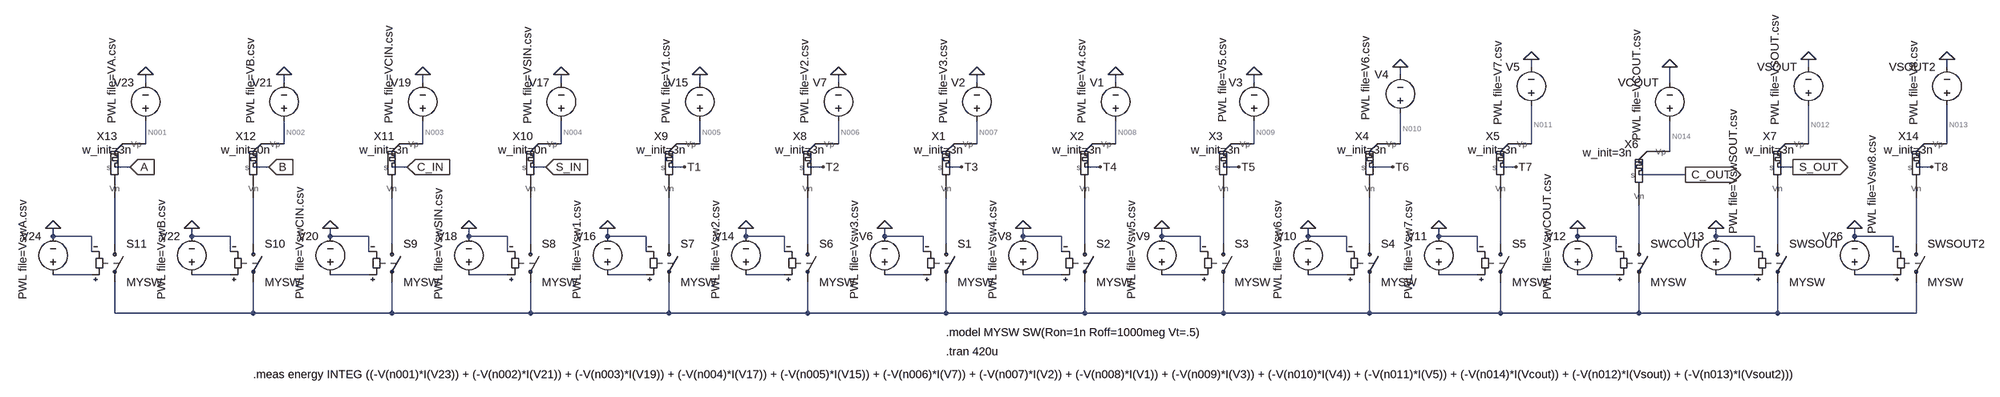
[diagram p0: schematic approx2_PPU.asc]
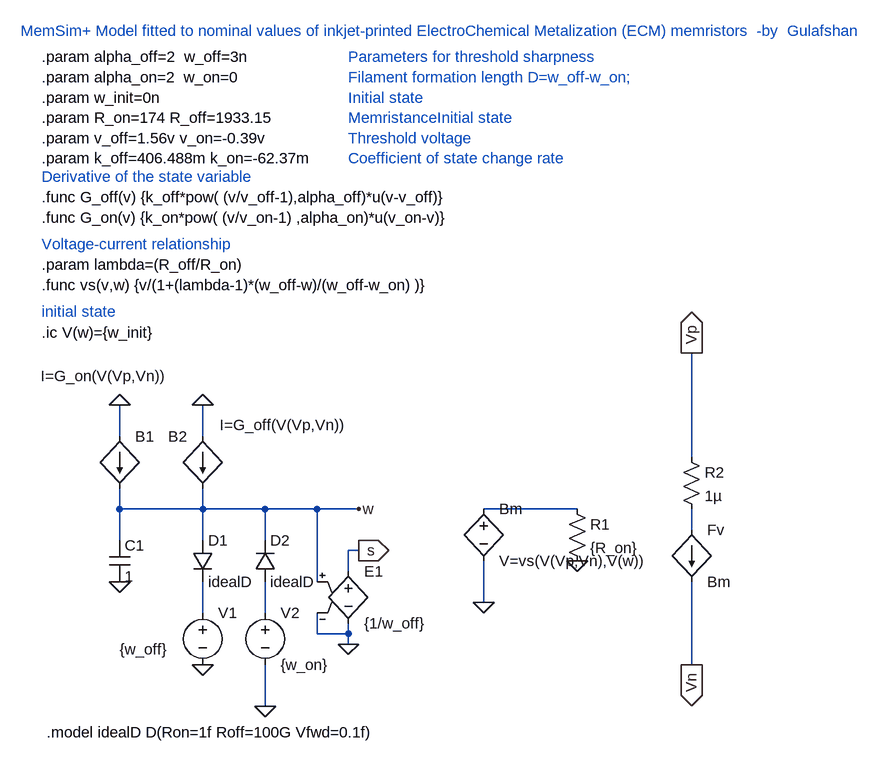
[diagram p1: sub-circuit memsim+ecm_nominal.asc]
approx2_PPU.asc, the LTspice schematic file:
Version 4
SHEET 1 3080 680
WIRE 1200 -16 1200 -32
WIRE 1776 -16 1776 -32
WIRE 2064 -16 2064 -32
WIRE 928 0 928 -16
WIRE -1680 16 -1680 0
WIRE -1392 16 -1392 0
WIRE -1104 16 -1104 0
WIRE -816 16 -816 0
WIRE -528 16 -528 0
WIRE -240 16 -240 0
WIRE 48 16 48 0
WIRE 336 16 336 0
WIRE 624 16 624 0
WIRE 1488 16 1488 -16
WIRE -1680 144 -1680 96
WIRE -1392 144 -1392 96
WIRE -1104 144 -1104 96
WIRE -816 144 -816 96
WIRE -528 144 -528 96
WIRE -240 144 -240 96
WIRE 48 144 48 96
WIRE 336 144 336 96
WIRE 624 144 624 96
WIRE 928 144 928 80
WIRE 1200 144 1200 64
WIRE 1776 144 1776 64
WIRE 2064 144 2064 64
WIRE 1488 160 1488 96
WIRE -1712 192 -1744 192
WIRE -1424 192 -1456 192
WIRE -1136 192 -1168 192
WIRE -848 192 -880 192
WIRE -560 192 -592 192
WIRE -272 192 -304 192
WIRE 16 192 -16 192
WIRE 304 192 272 192
WIRE 592 192 560 192
WIRE 912 192 864 192
WIRE 1168 192 1136 192
WIRE 1744 192 1712 192
WIRE 2032 192 2000 192
WIRE 1520 208 1424 208
WIRE -1872 336 -1872 320
WIRE -1792 336 -1872 336
WIRE -1584 336 -1584 320
WIRE -1504 336 -1584 336
WIRE -1296 336 -1296 320
WIRE -1216 336 -1296 336
WIRE -1008 336 -1008 320
WIRE -928 336 -1008 336
WIRE -720 336 -720 320
WIRE -640 336 -720 336
WIRE -432 336 -432 320
WIRE -352 336 -432 336
WIRE -144 336 -144 320
WIRE -64 336 -144 336
WIRE 144 336 144 320
WIRE 224 336 144 336
WIRE 432 336 432 320
WIRE 512 336 432 336
WIRE 736 336 736 320
WIRE 816 336 736 336
WIRE 1008 336 1008 320
WIRE 1088 336 1008 336
WIRE 1296 336 1296 320
WIRE 1376 336 1296 336
WIRE 1584 336 1584 320
WIRE 1664 336 1584 336
WIRE 1872 336 1872 320
WIRE 1952 336 1872 336
WIRE -1744 352 -1744 256
WIRE -1456 352 -1456 256
WIRE -1168 352 -1168 256
WIRE -880 352 -880 256
WIRE -592 352 -592 256
WIRE -304 352 -304 256
WIRE -16 352 -16 256
WIRE 272 352 272 256
WIRE 560 352 560 256
WIRE 864 352 864 256
WIRE 1136 352 1136 256
WIRE 1424 352 1424 272
WIRE 1712 352 1712 256
WIRE 2000 352 2000 256
WIRE -1792 368 -1792 336
WIRE -1504 368 -1504 336
WIRE -1216 368 -1216 336
WIRE -928 368 -928 336
WIRE -640 368 -640 336
WIRE -352 368 -352 336
WIRE -64 368 -64 336
WIRE 224 368 224 336
WIRE 512 368 512 336
WIRE 816 368 816 336
WIRE 1088 368 1088 336
WIRE 1376 368 1376 336
WIRE 1664 368 1664 336
WIRE 1952 368 1952 336
WIRE -1792 416 -1872 416
WIRE -1504 416 -1584 416
WIRE -1216 416 -1296 416
WIRE -928 416 -1008 416
WIRE -640 416 -720 416
WIRE -352 416 -432 416
WIRE -64 416 -144 416
WIRE 224 416 144 416
WIRE 512 416 432 416
WIRE 816 416 736 416
WIRE 1088 416 1008 416
WIRE 1376 416 1296 416
WIRE 1664 416 1584 416
WIRE 1952 416 1872 416
WIRE -1744 496 -1744 432
WIRE -1456 496 -1456 432
WIRE -1456 496 -1744 496
WIRE -1168 496 -1168 432
WIRE -1168 496 -1456 496
WIRE -880 496 -880 432
WIRE -880 496 -1168 496
WIRE -592 496 -592 432
WIRE -592 496 -880 496
WIRE -304 496 -304 432
WIRE -304 496 -592 496
WIRE -16 496 -16 432
WIRE -16 496 -304 496
WIRE 272 496 272 432
WIRE 272 496 -16 496
WIRE 560 496 560 432
WIRE 560 496 272 496
WIRE 864 496 864 432
WIRE 864 496 560 496
WIRE 1136 496 1136 432
WIRE 1136 496 864 496
WIRE 1424 496 1424 432
WIRE 1424 496 1136 496
WIRE 1712 496 1712 432
WIRE 1712 496 1424 496
WIRE 2000 496 2000 432
WIRE 2000 496 1712 496
FLAG 304 192 T4
FLAG 336 0 0
FLAG 624 0 0
FLAG 928 -16 0
FLAG 1200 -32 0
FLAG 1488 -16 0
FLAG 144 320 0
FLAG 432 320 0
FLAG 736 320 0
FLAG 1008 320 0
FLAG 1296 320 0
FLAG 1776 -32 0
FLAG 1584 320 0
FLAG 1744 192 S_OUT
IOPIN 1744 192 Out
FLAG 592 192 T5
FLAG 912 192 T6
FLAG 1168 192 T7
FLAG 1520 208 C_OUT
IOPIN 1520 208 Out
FLAG 16 192 T3
FLAG 48 0 0
FLAG -144 320 0
FLAG -272 192 T2
FLAG -240 0 0
FLAG -432 320 0
FLAG -560 192 T1
FLAG -528 0 0
FLAG -720 320 0
FLAG -848 192 S_IN
IOPIN -848 192 In
FLAG -816 0 0
FLAG -1008 320 0
FLAG -1136 192 C_IN
IOPIN -1136 192 In
FLAG -1104 0 0
FLAG -1296 320 0
FLAG -1424 192 B
IOPIN -1424 192 In
FLAG -1392 0 0
FLAG -1584 320 0
FLAG -1712 192 A
IOPIN -1712 192 In
FLAG -1680 0 0
FLAG -1872 320 0
FLAG 2064 -32 0
FLAG 1872 320 0
FLAG 2032 192 T8
SYMBOL MemSim+ECM_Nominal 224 144 R0
WINDOW 39 32 28 Bottom 2
SYMATTR SpiceLine w_init=3n
SYMATTR InstName X2
SYMBOL MemSim+ECM_Nominal 512 144 R0
WINDOW 39 32 28 Bottom 2
SYMATTR SpiceLine w_init=3n
SYMATTR InstName X3
SYMBOL MemSim+ECM_Nominal 816 144 R0
WINDOW 39 32 28 Bottom 2
SYMATTR SpiceLine w_init=3n
SYMATTR InstName X4
SYMBOL MemSim+ECM_Nominal 1088 144 R0
WINDOW 39 32 28 Bottom 2
SYMATTR SpiceLine w_init=3n
SYMATTR InstName X5
SYMBOL MemSim+ECM_Nominal 1376 160 R0
WINDOW 39 -18 18 Bottom 2
SYMATTR SpiceLine w_init=3n
SYMATTR InstName X6
SYMBOL voltage 336 112 R180
WINDOW 0 24 96 Left 2
WINDOW 3 70 10 VRight 2
WINDOW 123 0 0 Left 2
WINDOW 39 0 0 Left 2
SYMATTR InstName V1
SYMATTR Value PWL file=V4.csv
SYMBOL voltage 624 112 R180
WINDOW 0 24 96 Left 2
WINDOW 3 66 13 VRight 2
WINDOW 123 0 0 Left 2
WINDOW 39 0 0 Left 2
SYMATTR InstName V3
SYMATTR Value PWL file=V5.csv
SYMBOL voltage 928 96 R180
WINDOW 0 24 96 Left 2
WINDOW 3 72 1 VRight 2
WINDOW 123 0 0 Left 2
WINDOW 39 0 0 Left 2
SYMATTR InstName V4
SYMATTR Value PWL file=V6.csv
SYMBOL voltage 1200 80 R180
WINDOW 0 24 96 Left 2
WINDOW 3 69 -25 VRight 2
WINDOW 123 0 0 Left 2
WINDOW 39 0 0 Left 2
SYMATTR InstName V5
SYMATTR Value PWL file=V7.csv
SYMBOL sw 272 336 R0
SYMATTR InstName S2
SYMATTR Value MYSW
SYMBOL voltage 144 432 R180
WINDOW 0 24 96 Left 2
WINDOW 3 63 -36 VRight 2
WINDOW 123 0 0 Left 2
WINDOW 39 0 0 Left 2
SYMATTR InstName V8
SYMATTR Value PWL file=Vsw4.csv
SYMBOL sw 560 336 R0
SYMATTR InstName S3
SYMATTR Value MYSW
SYMBOL voltage 432 432 R180
WINDOW 0 24 96 Left 2
WINDOW 3 63 -36 VRight 2
WINDOW 123 0 0 Left 2
WINDOW 39 0 0 Left 2
SYMATTR InstName V9
SYMATTR Value PWL file=Vsw5.csv
SYMBOL sw 864 336 R0
SYMATTR InstName S4
SYMATTR Value MYSW
SYMBOL voltage 736 432 R180
WINDOW 0 24 96 Left 2
WINDOW 3 63 -36 VRight 2
WINDOW 123 0 0 Left 2
WINDOW 39 0 0 Left 2
SYMATTR InstName V10
SYMATTR Value PWL file=Vsw6.csv
SYMBOL sw 1136 336 R0
SYMATTR InstName S5
SYMATTR Value MYSW
SYMBOL voltage 1008 432 R180
WINDOW 0 24 96 Left 2
WINDOW 3 63 -36 VRight 2
WINDOW 123 0 0 Left 2
WINDOW 39 0 0 Left 2
SYMATTR InstName V11
SYMATTR Value PWL file=Vsw7.csv
SYMBOL sw 1424 336 R0
SYMATTR InstName SWCOUT
SYMATTR Value MYSW
SYMBOL voltage 1296 432 R180
WINDOW 0 24 96 Left 2
WINDOW 3 63 -36 VRight 2
WINDOW 123 0 0 Left 2
WINDOW 39 0 0 Left 2
SYMATTR InstName V12
SYMATTR Value PWL file=VswCOUT.csv
SYMBOL MemSim+ECM_Nominal 1664 144 R0
WINDOW 39 32 28 Bottom 2
SYMATTR SpiceLine w_init=3n
SYMATTR InstName X7
SYMBOL voltage 1488 112 R180
WINDOW 0 24 96 Left 2
WINDOW 3 69 -25 VRight 2
WINDOW 123 0 0 Left 2
WINDOW 39 0 0 Left 2
SYMATTR InstName VCOUT
SYMATTR Value PWL file=VCOUT.csv
SYMBOL sw 1712 336 R0
SYMATTR InstName SWSOUT
SYMATTR Value MYSW
SYMBOL voltage 1584 432 R180
WINDOW 0 24 96 Left 2
WINDOW 3 -36 100 VRight 2
WINDOW 123 0 0 Left 2
WINDOW 39 0 0 Left 2
SYMATTR InstName V13
SYMATTR Value PWL file=VswSOUT.csv
SYMBOL voltage 1776 80 R180
WINDOW 0 24 96 Left 2
WINDOW 3 69 -25 VRight 2
WINDOW 123 0 0 Left 2
WINDOW 39 0 0 Left 2
SYMATTR InstName VSOUT
SYMATTR Value PWL file=VSOUT.csv
SYMBOL MemSim+ECM_Nominal -64 144 R0
WINDOW 39 32 28 Bottom 2
SYMATTR SpiceLine w_init=3n
SYMATTR InstName X1
SYMBOL voltage 48 112 R180
WINDOW 0 24 96 Left 2
WINDOW 3 70 10 VRight 2
WINDOW 123 0 0 Left 2
WINDOW 39 0 0 Left 2
SYMATTR InstName V2
SYMATTR Value PWL file=V3.csv
SYMBOL sw -16 336 R0
SYMATTR InstName S1
SYMATTR Value MYSW
SYMBOL voltage -144 432 R180
WINDOW 0 24 96 Left 2
WINDOW 3 63 -36 VRight 2
WINDOW 123 0 0 Left 2
WINDOW 39 0 0 Left 2
SYMATTR InstName V6
SYMATTR Value PWL file=Vsw3.csv
SYMBOL MemSim+ECM_Nominal -352 144 R0
WINDOW 39 32 28 Bottom 2
SYMATTR SpiceLine w_init=3n
SYMATTR InstName X8
SYMBOL voltage -240 112 R180
WINDOW 0 24 96 Left 2
WINDOW 3 70 10 VRight 2
WINDOW 123 0 0 Left 2
WINDOW 39 0 0 Left 2
SYMATTR InstName V7
SYMATTR Value PWL file=V2.csv
SYMBOL sw -304 336 R0
SYMATTR InstName S6
SYMATTR Value MYSW
SYMBOL voltage -432 432 R180
WINDOW 0 24 96 Left 2
WINDOW 3 63 -36 VRight 2
WINDOW 123 0 0 Left 2
WINDOW 39 0 0 Left 2
SYMATTR InstName V14
SYMATTR Value PWL file=Vsw2.csv
SYMBOL MemSim+ECM_Nominal -640 144 R0
WINDOW 39 32 28 Bottom 2
SYMATTR SpiceLine w_init=3n
SYMATTR InstName X9
SYMBOL voltage -528 112 R180
WINDOW 0 24 96 Left 2
WINDOW 3 70 10 VRight 2
WINDOW 123 0 0 Left 2
WINDOW 39 0 0 Left 2
SYMATTR InstName V15
SYMATTR Value PWL file=V1.csv
SYMBOL sw -592 336 R0
SYMATTR InstName S7
SYMATTR Value MYSW
SYMBOL voltage -720 432 R180
WINDOW 0 24 96 Left 2
WINDOW 3 63 -36 VRight 2
WINDOW 123 0 0 Left 2
WINDOW 39 0 0 Left 2
SYMATTR InstName V16
SYMATTR Value PWL file=Vsw1.csv
SYMBOL MemSim+ECM_Nominal -928 144 R0
WINDOW 39 32 28 Bottom 2
SYMATTR SpiceLine w_init=0n
SYMATTR InstName X10
SYMBOL voltage -816 112 R180
WINDOW 0 24 96 Left 2
WINDOW 3 70 10 VRight 2
WINDOW 123 0 0 Left 2
WINDOW 39 0 0 Left 2
SYMATTR InstName V17
SYMATTR Value PWL file=VSIN.csv
SYMBOL sw -880 336 R0
SYMATTR InstName S8
SYMATTR Value MYSW
SYMBOL voltage -1008 432 R180
WINDOW 0 24 96 Left 2
WINDOW 3 63 -36 VRight 2
WINDOW 123 0 0 Left 2
WINDOW 39 0 0 Left 2
SYMATTR InstName V18
SYMATTR Value PWL file=VswSIN.csv
SYMBOL MemSim+ECM_Nominal -1216 144 R0
WINDOW 39 32 28 Bottom 2
SYMATTR SpiceLine w_init=3n
SYMATTR InstName X11
SYMBOL voltage -1104 112 R180
WINDOW 0 24 96 Left 2
WINDOW 3 70 10 VRight 2
WINDOW 123 0 0 Left 2
WINDOW 39 0 0 Left 2
SYMATTR InstName V19
SYMATTR Value PWL file=VCIN.csv
SYMBOL sw -1168 336 R0
SYMATTR InstName S9
SYMATTR Value MYSW
SYMBOL voltage -1296 432 R180
WINDOW 0 24 96 Left 2
WINDOW 3 63 -36 VRight 2
WINDOW 123 0 0 Left 2
WINDOW 39 0 0 Left 2
SYMATTR InstName V20
SYMATTR Value PWL file=VswCIN.csv
SYMBOL MemSim+ECM_Nominal -1504 144 R0
WINDOW 39 32 28 Bottom 2
SYMATTR SpiceLine w_init=0n
SYMATTR InstName X12
SYMBOL voltage -1392 112 R180
WINDOW 0 24 96 Left 2
WINDOW 3 70 10 VRight 2
WINDOW 123 0 0 Left 2
WINDOW 39 0 0 Left 2
SYMATTR InstName V21
SYMATTR Value PWL file=VB.csv
SYMBOL sw -1456 336 R0
SYMATTR InstName S10
SYMATTR Value MYSW
SYMBOL voltage -1584 432 R180
WINDOW 0 24 96 Left 2
WINDOW 3 63 -36 VRight 2
WINDOW 123 0 0 Left 2
WINDOW 39 0 0 Left 2
SYMATTR InstName V22
SYMATTR Value PWL file=VswB.csv
SYMBOL MemSim+ECM_Nominal -1792 144 R0
WINDOW 39 32 28 Bottom 2
SYMATTR SpiceLine w_init=3n
SYMATTR InstName X13
SYMBOL voltage -1680 112 R180
WINDOW 0 24 96 Left 2
WINDOW 3 70 10 VRight 2
WINDOW 123 0 0 Left 2
WINDOW 39 0 0 Left 2
SYMATTR InstName V23
SYMATTR Value PWL file=VA.csv
SYMBOL sw -1744 336 R0
SYMATTR InstName S11
SYMATTR Value MYSW
SYMBOL voltage -1872 432 R180
WINDOW 0 24 96 Left 2
WINDOW 3 63 -36 VRight 2
WINDOW 123 0 0 Left 2
WINDOW 39 0 0 Left 2
SYMATTR InstName V24
SYMATTR Value PWL file=VswA.csv
SYMBOL MemSim+ECM_Nominal 1952 144 R0
WINDOW 39 32 28 Bottom 2
SYMATTR SpiceLine w_init=3n
SYMATTR InstName X14
SYMBOL sw 2000 336 R0
SYMATTR InstName SWSOUT2
SYMATTR Value MYSW
SYMBOL voltage 1872 432 R180
WINDOW 0 24 96 Left 2
WINDOW 3 -36 100 VRight 2
WINDOW 123 0 0 Left 2
WINDOW 39 0 0 Left 2
SYMATTR InstName V26
SYMATTR Value PWL file=Vsw8.csv
SYMBOL voltage 2064 80 R180
WINDOW 0 24 96 Left 2
WINDOW 3 69 -25 VRight 2
WINDOW 123 0 0 Left 2
WINDOW 39 0 0 Left 2
SYMATTR InstName VSOUT2
SYMATTR Value PWL file=V8.csv
TEXT -16 576 Left 2 !.tran 420u
TEXT -16 536 Left 2 !.model MYSW SW(Ron=1n Roff=1000meg Vt=.5)
TEXT -1456 624 Left 2 !.meas energy INTEG ((-V(n001)*I(V23)) + (-V(n002)*I(V21)) + (-V(n003)*I(V19)) + (-V(n004)*I(V17)) + (-V(n005)*I(V15)) + (-V(n006)*I(V7)) + (-V(n007)*I(V2)) + (-V(n008)*I(V1)) + (-V(n009)*I(V3)) + (-V(n010)*I(V4)) + (-V(n011)*I(V5)) + (-V(n014)*I(Vcout)) + (-V(n012)*I(Vsout)) + (-V(n013)*I(Vsout2)))

memsim+ecm_nominal.asc, the sub-circuit schematic file:
Version 4
SHEET 1 3964 1792
WIRE 160 400 160 352
WIRE 288 400 288 352
WIRE 1040 432 1040 272
WIRE 160 512 160 480
WIRE 288 512 288 480
WIRE 288 512 160 512
WIRE 384 512 288 512
WIRE 464 512 384 512
WIRE 528 512 464 512
WIRE 864 512 720 512
WIRE 1040 544 1040 512
WIRE 160 560 160 512
WIRE 288 560 288 512
WIRE 384 560 384 512
WIRE 528 576 512 576
WIRE 512 608 512 576
WIRE 464 624 464 512
WIRE 720 656 720 592
WIRE 288 672 288 624
WIRE 384 672 384 624
WIRE 464 704 464 672
WIRE 512 704 512 688
WIRE 512 704 464 704
WIRE 512 720 512 704
WIRE 1040 752 1040 624
WIRE 384 816 384 752
FLAG 160 352 0
FLAG 288 352 0
FLAG 160 624 0
FLAG 288 752 0
FLAG 528 512 w
FLAG 720 656 0
FLAG 864 592 0
FLAG 512 720 0
FLAG 528 576 s
IOPIN 528 576 Out
FLAG 1040 272 Vp
IOPIN 1040 272 Out
FLAG 1040 752 Vn
IOPIN 1040 752 Out
FLAG 384 816 0
SYMBOL bi 160 400 R0
WINDOW 3 -121 -93 Left 2
SYMATTR Value I=G_on(V(Vp,Vn))
SYMATTR InstName B1
SYMBOL bi 288 400 M0
WINDOW 3 -220 -17 Left 2
SYMATTR Value I=G_off(V(Vp,Vn))
SYMATTR InstName B2
SYMBOL cap 144 560 R0
SYMATTR InstName C1
SYMATTR Value 1
SYMBOL diode 272 560 R0
SYMATTR InstName D1
SYMATTR Value idealD
SYMBOL diode 368 624 M180
WINDOW 0 24 64 Left 2
WINDOW 3 24 0 Left 2
SYMATTR InstName D2
SYMATTR Value idealD
SYMBOL voltage 288 656 R0
WINDOW 123 0 0 Left 2
WINDOW 39 0 0 Left 2
WINDOW 3 -128 72 Left 2
SYMATTR Value {w_off}
SYMATTR InstName V1
SYMBOL res 848 496 R0
SYMATTR InstName R1
SYMATTR Value {R_on}
SYMBOL f 1040 544 R0
SYMATTR InstName Fv
SYMATTR Value Bm
SYMATTR Value2 -1
SYMBOL bv 720 496 R0
SYMATTR InstName Bm
SYMATTR Value V=vs(V(Vp,Vn),V(w))
SYMBOL e 512 592 R0
SYMATTR InstName E1
SYMATTR Value {1/w_off}
SYMBOL res 1024 416 R0
SYMATTR InstName R2
SYMATTR Value 1µ
SYMBOL voltage 384 656 R0
WINDOW 123 0 0 Left 0
WINDOW 39 0 0 Left 0
SYMATTR InstName V2
SYMATTR Value {w_on}
TEXT 8 -224 Left 2 ;MemSim+ Model fitted to nominal values of inkjet-printed ElectroChemical Metalization (ECM) memristors  -by  Gulafshan
TEXT 40 240 Left 2 !.ic V(w)={w_init}
TEXT 40 0 Left 2 ;Derivative of the state variable
TEXT 40 104 Left 2 ;Voltage-current relationship
TEXT 40 208 Left 2 ;initial state
TEXT 48 856 Left 2 !.model idealD D(Ron=1f Roff=100G Vfwd=0.1f)
TEXT 40 -184 Left 2 !.param alpha_off=2  w_off=3n\n.param alpha_on=2  w_on=0\n.param w_init=0n\n.param R_on=174 R_off=1933.15\n.param v_off=1.56v v_on=-0.39v\n.param k_off=406.488m k_on=-62.37m
TEXT 40 32 Left 2 !.func G_off(v) {k_off*pow( (v/v_off-1),alpha_off)*u(v-v_off)}\n.func G_on(v) {k_on*pow( (v/v_on-1) ,alpha_on)*u(v_on-v)}
TEXT 40 136 Left 2 !.param lambda=(R_off/R_on)\n.func vs(v,w) {v/(1+(lambda-1)*(w_off-w)/(w_off-w_on) )}
TEXT 512 -184 Left 2 ;Parameters for threshold sharpness\nFilament formation length D=w_off-w_on;\nInitial state \nMemristanceInitial state\nThreshold voltage\nCoefficient of state change rate

The netlist it stands for:
* approx2_PPU.asc
XX2 T4 N008 N022 memsim+ecm_nominal params: w_init=3n
XX3 T5 N009 N023 memsim+ecm_nominal params: w_init=3n
XX4 T6 N010 N024 memsim+ecm_nominal params: w_init=3n
XX5 T7 N011 N025 memsim+ecm_nominal params: w_init=3n
XX6 C_OUT N014 N026 memsim+ecm_nominal params: w_init=3n
V1 N008 0 PWL file=V4.csv
V3 N009 0 PWL file=V5.csv
V4 N010 0 PWL file=V6.csv
V5 N011 0 PWL file=V7.csv
S2 N022 N043 N036 0 MYSW
V8 N036 0 PWL file=Vsw4.csv
S3 N023 N043 N037 0 MYSW
V9 N037 0 PWL file=Vsw5.csv
S4 N024 N043 N038 0 MYSW
V10 N038 0 PWL file=Vsw6.csv
S5 N025 N043 N039 0 MYSW
V11 N039 0 PWL file=Vsw7.csv
SWCOUT N026 N043 N040 0 MYSW
V12 N040 0 PWL file=VswCOUT.csv
XX7 S_OUT N012 N027 memsim+ecm_nominal params: w_init=3n
VCOUT N014 0 PWL file=VCOUT.csv
SWSOUT N027 N043 N041 0 MYSW
V13 N041 0 PWL file=VswSOUT.csv
VSOUT N012 0 PWL file=VSOUT.csv
XX1 T3 N007 N021 memsim+ecm_nominal params: w_init=3n
V2 N007 0 PWL file=V3.csv
S1 N021 N043 N035 0 MYSW
V6 N035 0 PWL file=Vsw3.csv
XX8 T2 N006 N020 memsim+ecm_nominal params: w_init=3n
V7 N006 0 PWL file=V2.csv
S6 N020 N043 N034 0 MYSW
V14 N034 0 PWL file=Vsw2.csv
XX9 T1 N005 N019 memsim+ecm_nominal params: w_init=3n
V15 N005 0 PWL file=V1.csv
S7 N019 N043 N033 0 MYSW
V16 N033 0 PWL file=Vsw1.csv
XX10 S_IN N004 N018 memsim+ecm_nominal params: w_init=0n
V17 N004 0 PWL file=VSIN.csv
S8 N018 N043 N032 0 MYSW
V18 N032 0 PWL file=VswSIN.csv
XX11 C_IN N003 N017 memsim+ecm_nominal params: w_init=3n
V19 N003 0 PWL file=VCIN.csv
S9 N017 N043 N031 0 MYSW
V20 N031 0 PWL file=VswCIN.csv
XX12 B N002 N016 memsim+ecm_nominal params: w_init=0n
V21 N002 0 PWL file=VB.csv
S10 N016 N043 N030 0 MYSW
V22 N030 0 PWL file=VswB.csv
XX13 A N001 N015 memsim+ecm_nominal params: w_init=3n
V23 N001 0 PWL file=VA.csv
S11 N015 N043 N029 0 MYSW
V24 N029 0 PWL file=VswA.csv
XX14 T8 N013 N028 memsim+ecm_nominal params: w_init=3n
SWSOUT2 N028 N043 N042 0 MYSW
V26 N042 0 PWL file=Vsw8.csv
VSOUT2 N013 0 PWL file=V8.csv

* block symbol definitions
.subckt memsim+ecm_nominal s Vp Vn
B1 0 w I=G_on(V(Vp,Vn))
B2 0 w I=G_off(V(Vp,Vn))
C1 w 0 1
D1 w N003 idealD
D2 N004 w idealD
V1 N003 0 {w_off}
R1 N001 0 {R_on}
Fv N002 Vn Bm -1
Bm N001 0 V=vs(V(Vp,Vn),V(w))
E1 s 0 w 0 {1/w_off}
R2 Vp N002 1µ
V2 N004 0 {w_on}
* MemSim+ Model fitted to nominal values of inkjet-printed ElectroChemical Metalization (ECM) memristors  -by  Gulafshan
.ic V(w)={w_init}
* Derivative of the state variable
* Voltage-current relationship
* initial state
.model idealD D(Ron=1f Roff=100G Vfwd=0.1f)
.param alpha_off=2  w_off=3n
.param alpha_on=2  w_on=0
.param w_init=0n
.param R_on=174 R_off=1933.15
.param v_off=1.56v v_on=-0.39v
.param k_off=406.488m k_on=-62.37m
.func G_off(v) {k_off*pow( (v/v_off-1),alpha_off)*u(v-v_off)}
.func G_on(v) {k_on*pow( (v/v_on-1) ,alpha_on)*u(v_on-v)}
.param lambda=(R_off/R_on)
.func vs(v,w) {v/(1+(lambda-1)*(w_off-w)/(w_off-w_on) )}
* Parameters for threshold sharpness
* Filament formation length D=w_off-w_on;
* Initial state
* MemristanceInitial state
* Threshold voltage
* Coefficient of state change rate
.ends memsim+ecm_nominal

.model D D
.lib standard.dio
.tran 420u
.model MYSW SW(Ron=1n Roff=1000meg Vt=.5)
.meas energy INTEG ((-V(n001)*I(V23)) + (-V(n002)*I(V21)) + (-V(n003)*I(V19)) + (-V(n004)*I(V17)) + (-V(n005)*I(V15)) + (-V(n006)*I(V7)) + (-V(n007)*I(V2)) + (-V(n008)*I(V1)) + (-V(n009)*I(V3)) + (-V(n010)*I(V4)) + (-V(n011)*I(V5)) + (-V(n014)*I(Vcout)) + (-V(n012)*I(Vsout)) + (-V(n013)*I(Vsout2)))
.backanno
.end